# Altium project Portable_power_supply_v1.PrjPcb
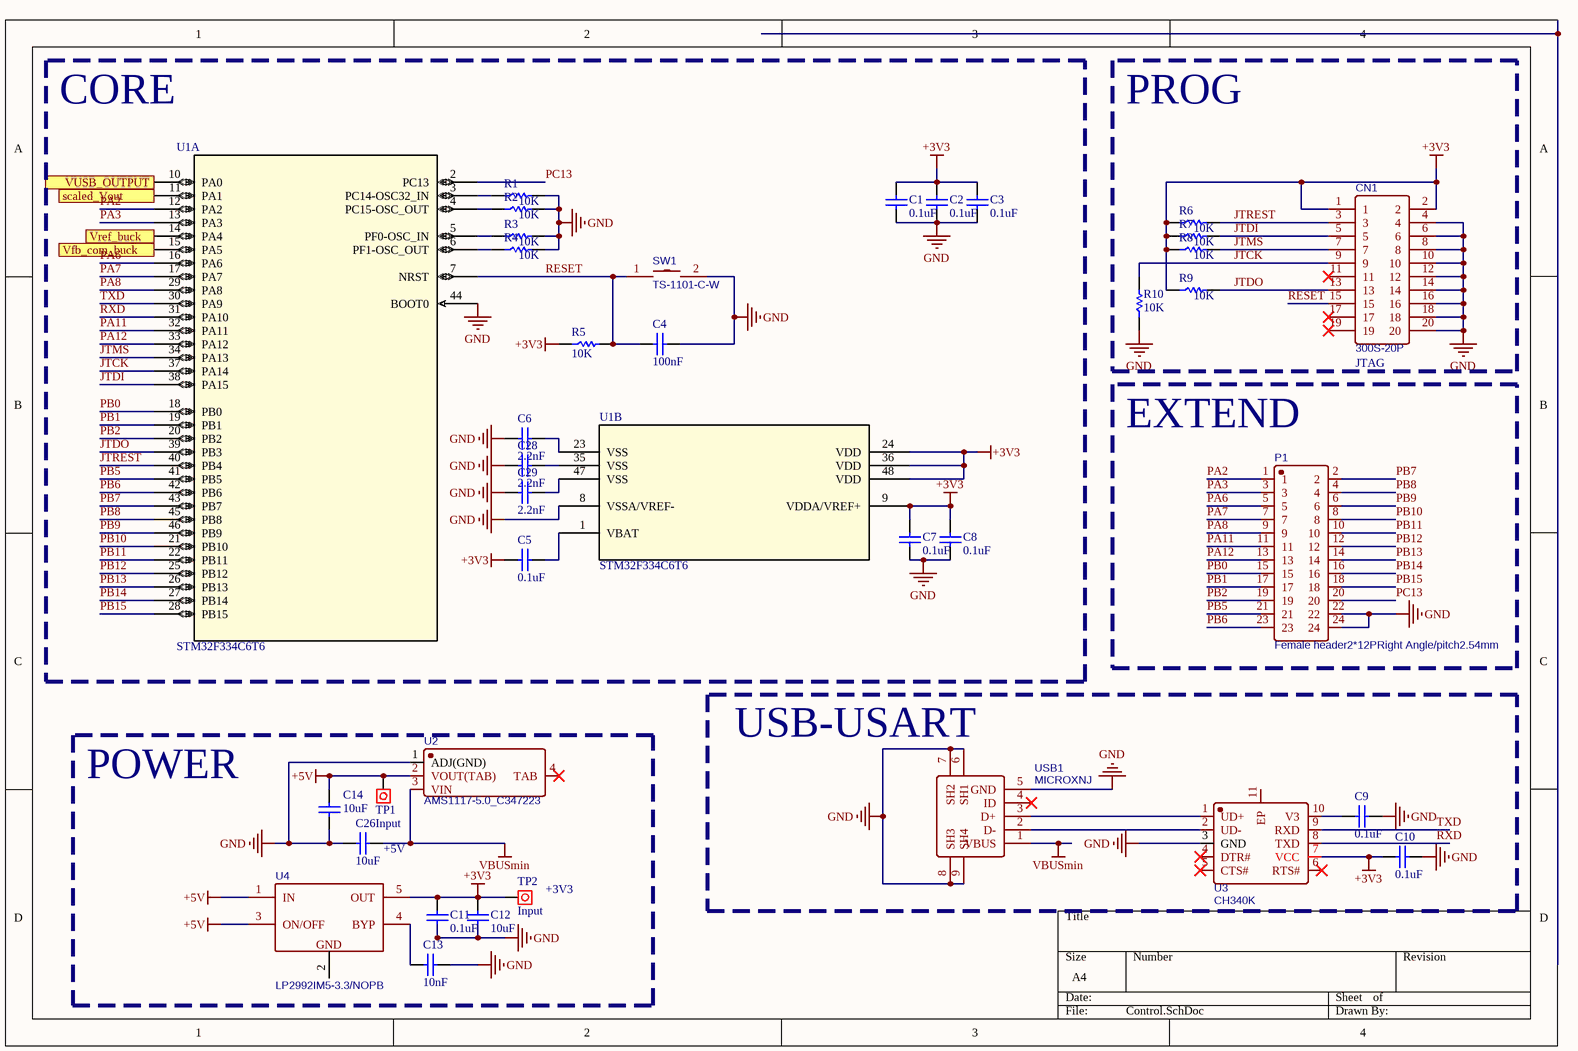
[diagram p0: Control.SchDoc]
2 sheets, 62 parts. Net scope: flat (ports and power ports of the same name join across sheets).
Board file: Portable power supply version2.PcbDoc
Sheets:
  Control.SchDoc
  Front(LDR).SchDoc

## Sheet Control.SchDoc
size A4; SheetNumber: 1; SheetTotal: 4

### Parts
C1  0.1uF  [0805C]
C2  0.1uF  [0805C]
C3  0.1uF  [0805C]
C4  100nF  [0805C]
C5  0.1uF  [0805C]
C6  2.2nF  [0805C]
C7  0.1uF  [0805C]
C8  0.1uF  [0805C]
C9  0.1uF  [0805C]
C10  0.1uF  [0805C]
C11  0.1uF  [0805C]
C12  10uF  [0805C]
C13  10nF  [0805C]
C14  10uF  [0805C]
C26  10uF  [0805C]
C28  2.2nF  [0805C]
C29  2.2nF  [0805C]
CN1  300S-20P  [CONN-TH_300S-20P]
P1  Female header2*12PRight Angle/pitch2.54mm  [HDR-TH_24P-P2.54-V-F-R2-C12-S2.54]
R1  10K  [0805]
R2  10K  [0805]
R3  10K  [0805]
R4  10K  [0805]
R5  10K  [0805]
R6  10K  [0805]
R7  10K  [0805]
R8  10K  [0805]
R9  10K  [0805]
R10  10K  [0805]
SW1  TS-1101-C-W  [SW-SMD_L6.0-W3.3-LS8.0]
TP1  INPUT  [Testpoin]
TP2  INPUT  [Testpoin]
U1  STM32F334C6T6  [LQFP48-7x7mm]  (parts A,B of 2)
U2  AMS1117-5.0_C347223  [SOT-223_L6.7-W3.5-P2.30-BR]
U3  CH340K  [ESOP-10_L4.9-W3.9-P1.00-LS6.2-BL-EP]
U4  LP2992IM5-3.3/NOPB  [SOT-23-5_L3.0-W1.7-P0.95-LS2.8-BR]
USB1  MICROXNJ  [MICRO-USB-SMD_MICROXNJ]

### Blocks framed on the sheet
CORE: C1-C8 C28 C29 R1-R5 SW1 U1
PROG: CN1 R6-R10
EXTEND: P1
POWER: C11-C14 C26 TP1 TP2 U2 U4
USB-USART: C9 C10 U3 USB1

### Ports
scaled_Vout (in), Vfb_com_buck (out), Vref_buck (out), VUSB_OUTPUT (in)

### Nets
+3V3: C1.1 C2.1 C3.1 C5.2 C7.1 C8.1 C10.2 C11.1 C12.1 CN1.1 CN1.2 R5.1 R6.1 R7.1 R8.1 R9.1 TP2.1 U1.9(VDDA/VREF+) U1.24(VDD) U1.36(VDD) U1.48(VDD) U3.7(VCC) U4.5(OUT)
+5V: C14.1 TP1.1 U2.2(VOUT(TAB)) U4.1(IN) U4.3(ON/OFF)
GND: C1.2 C2.2 C3.2 C4.1 C6.2 C7.2 C8.2 C9.2 C10.1 C11.2 C12.2 C13.1 C14.2 C26.2 C28.2 C29.2 CN1.4 CN1.6 CN1.8 CN1.10 CN1.12 CN1.14 CN1.16 CN1.18 CN1.20 P1.22 P1.24 R1.2 R2.2 R3.2 R4.2 R10.1 SW1.2 U1.8(VSSA/VREF-) U1.44(BOOT0) U2.1(ADJ(GND)) U3.3(GND) USB1.5(GND) USB1.6(SH1) USB1.7(SH2) USB1.8(SH3) USB1.9(SH4)
VBUSmin: C26.1 U2.3(VIN) USB1.1(VBUS)
JTCK: CN1.9 R10.2 U1.37(PA14)
JTDI: CN1.5 R7.2 U1.38(PA15)
JTDO: CN1.13 R9.2 U1.39(PB3)
JTMS: CN1.7 R8.2 U1.34(PA13)
JTREST: CN1.3 R6.2 U1.40(PB4)
PA2: P1.1 U1.12(PA2)
PA3: P1.3 U1.13(PA3)
PA6: P1.5 U1.16(PA6)
PA7: P1.7 U1.17(PA7)
PA8: P1.9 U1.29(PA8)
PA11: P1.11 U1.32(PA11)
PA12: P1.13 U1.33(PA12)
PB0: P1.15 U1.18(PB0)
PB1: P1.17 U1.19(PB1)
PB2: P1.19 U1.20(PB2)
PB5: P1.21 U1.41(PB5)
PB6: P1.23 U1.42(PB6)
PB7: P1.2 U1.43(PB7)
PB8: P1.4 U1.45(PB8)
PB9: P1.6 U1.46(PB9)
PB10: P1.8 U1.21(PB10)
PB11: P1.10 U1.22(PB11)
PB12: P1.12 U1.25(PB12)
PB13: P1.14 U1.26(PB13)
PB14: P1.16 U1.27(PB14)
PB15: P1.18 U1.28(PB15)
PC13: P1.20 U1.2(PC13)
RESET: C4.2 CN1.15 R5.2 SW1.1 U1.7(NRST)
RXD: U1.31(PA10) U3.8(TXD)
TXD: U1.30(PA9) U3.9(RXD)
NetC5_1: C5.1 U1.1(VBAT)
NetC6_1: C6.1 U1.23(VSS)
NetC9_1: C9.1 U3.10(V3)
NetC13_2: C13.2 U4.4(BYP)
NetC27_2: U1.10(PA0) ; port VUSB_OUTPUT
NetC28_1: C28.1 U1.35(VSS)
NetC29_1: C29.1 U1.47(VSS)
NetR1_1: R1.1 U1.3(PC14-OSC32_IN)
NetR2_1: R2.1 U1.4(PC15-OSC_OUT)
NetR3_1: R3.1 U1.5(PF0-OSC_IN)
NetR4_1: R4.1 U1.6(PF1-OSC_OUT)
NetU1_11: U1.11(PA1) ; port scaled_Vout
NetU1_14: U1.14(PA4) ; port Vref_buck
NetU1_15: U1.15(PA5) ; port Vfb_com_buck
NetU3_1: U3.1(UD+) USB1.3(D+)
NetU3_2: U3.2(UD-) USB1.2(D-)

Not connected (* = marked no-connect by the designer): CN1 11* 17* 19*; U2 4(TAB)*; U3 4(DTR#)* 5(CTS#)* 6(RTS#)* 11(EP); U4 2(GND); USB1 4(ID)*

### Notes on the sheet
- (near CN1) JTAG
- (near C26) +5V
- (near TP2) +3V3

### Library data of the parts
C1-C3 C5 C7-C11 = C_0.1uf: Capacitor; Reviewed by: RM - 2018/08/05; Revision: July-2002: Re-released for DXP Platform.; Supplier 1: *; Supplier Part Number 1: *; Value: 0.1uF
C4 = C_100nf: Capacitor; Reviewed by: RM - 2018/08/05; Revision: July-2002: Re-released for DXP Platform.; Supplier 1: *; Supplier Part Number 1: *; Value: 100nF
C6 C28 C29 = C_2.2nF: Capacitor; Reviewed by: RM - 2018/08/05; Revision: July-2002: Re-released for DXP Platform.; Supplier 1: *; Supplier Part Number 1: *; Value: 2.2nF
C12 C14 C26 = C_10uf: Capacitor; Reviewed by: RM - 2018/08/05; Revision: July-2002: Re-released for DXP Platform.; Supplier 1: *; Supplier Part Number 1: *; Value: 10uF
C13 = C_10nF: Capacitor; Reviewed by: RM - 2018/08/05; Revision: July-2002: Re-released for DXP Platform.; Supplier 1: *; Supplier Part Number 1: *; Value: 10nF
CN1 = 300S-20P: BOM_Manufacturer: Shenzhen Cankemeng; Contributor: LCSC; BOM_Supplier: LCSC; BOM_Supplier Part: C132442; BOM_Manufacturer Part: -; BOM_JLCPCB Part Class: Extended Part; spicePre: C; spiceSymbolName: 300S-20P
P1 = Female header2*12PRight Angle/pitch2.54mm: BOM_Manufacturer: BOOMELE; BOM_Supplier: LCSC; BOM_Manufacturer Part: Female header2*12PRight Angle/pitch2.54mm; BOM_Supplier Part: C62744; BOM_JLCPCB Part Class: Extended Part; spicePre: P; spiceSymbolName: Female header2*12PRight Angle/pitch2.54mm
R1-R10 = R_10k: Resistor; Reviewed by: RM - 2018/08/05; Supplier 1: *; Suppler Part Number 1: *; Value: 10K
SW1 = TS-1101-C-W: BOM_Manufacturer: XKB Connectivity(中国星坤); Contributor: LCSC; BOM_Supplier: LCSC; BOM_Supplier Part: C318938; BOM_Manufacturer Part: TS-1101-C-W; BOM_JLCPCB Part Class: Extended Part; spicePre: S; spiceSymbolName: TS-1101-C-W
TP1 TP2 = Test Point: Pad; Value: Input
U1 = STM32F334C6T6: No Description Available; Mfr_Name: STMicroelectronics; Copyright: Copyright (C) 2021 Ultra Librarian. All rights reserved.; Manufacturer_Part_Number: STM32F334C6T6; RefDes: RefDes; Type: DEV
U2 = AMS1117-5.0_C347223: BOM_Manufacturer: Youtai Semiconductor Co., Ltd.; Contributor: LCSC; BOM_Supplier: LCSC; BOM_Supplier Part: C347223; BOM_Manufacturer Part: AMS1117-5.0; BOM_JLCPCB Part Class: Extended Part; spicePre: U; spiceSymbolName: AMS1117-5.0_C347223
U3 = CH340K: BOM_Manufacturer: WCH(Jiangsu Qin Heng); Contributor: LCSC; BOM_Supplier: LCSC; BOM_Supplier Part: C968586; BOM_Manufacturer Part: CH340K; BOM_JLCPCB Part Class: Extended Part; spicePre: U; spiceSymbolName: CH340K
U4 = LP2992IM5-3.3/NOPB: BOM_Manufacturer: TI; Contributor: LCSC; BOM_Supplier: LCSC; BOM_Manufacturer Part: LP2992IM5-3.3/NOPB; BOM_Supplier Part: C129353; BOM_JLCPCB Part Class: Extended Part; spicePre: U; spiceSymbolName: LP2992IM5-3.3/NOPB
USB1 = MICROXNJ: BOM_Manufacturer: SHOU HAN; Contributor: LCSC; BOM_Supplier: LCSC; BOM_Supplier Part: C404969; BOM_Manufacturer Part: MicroXNJ; BOM_JLCPCB Part Class: Extended Part; spicePre: U; spiceSymbolName: MICROXNJ

## Sheet Front(LDR).SchDoc
size A4; SheetNumber: 2; SheetTotal: 4
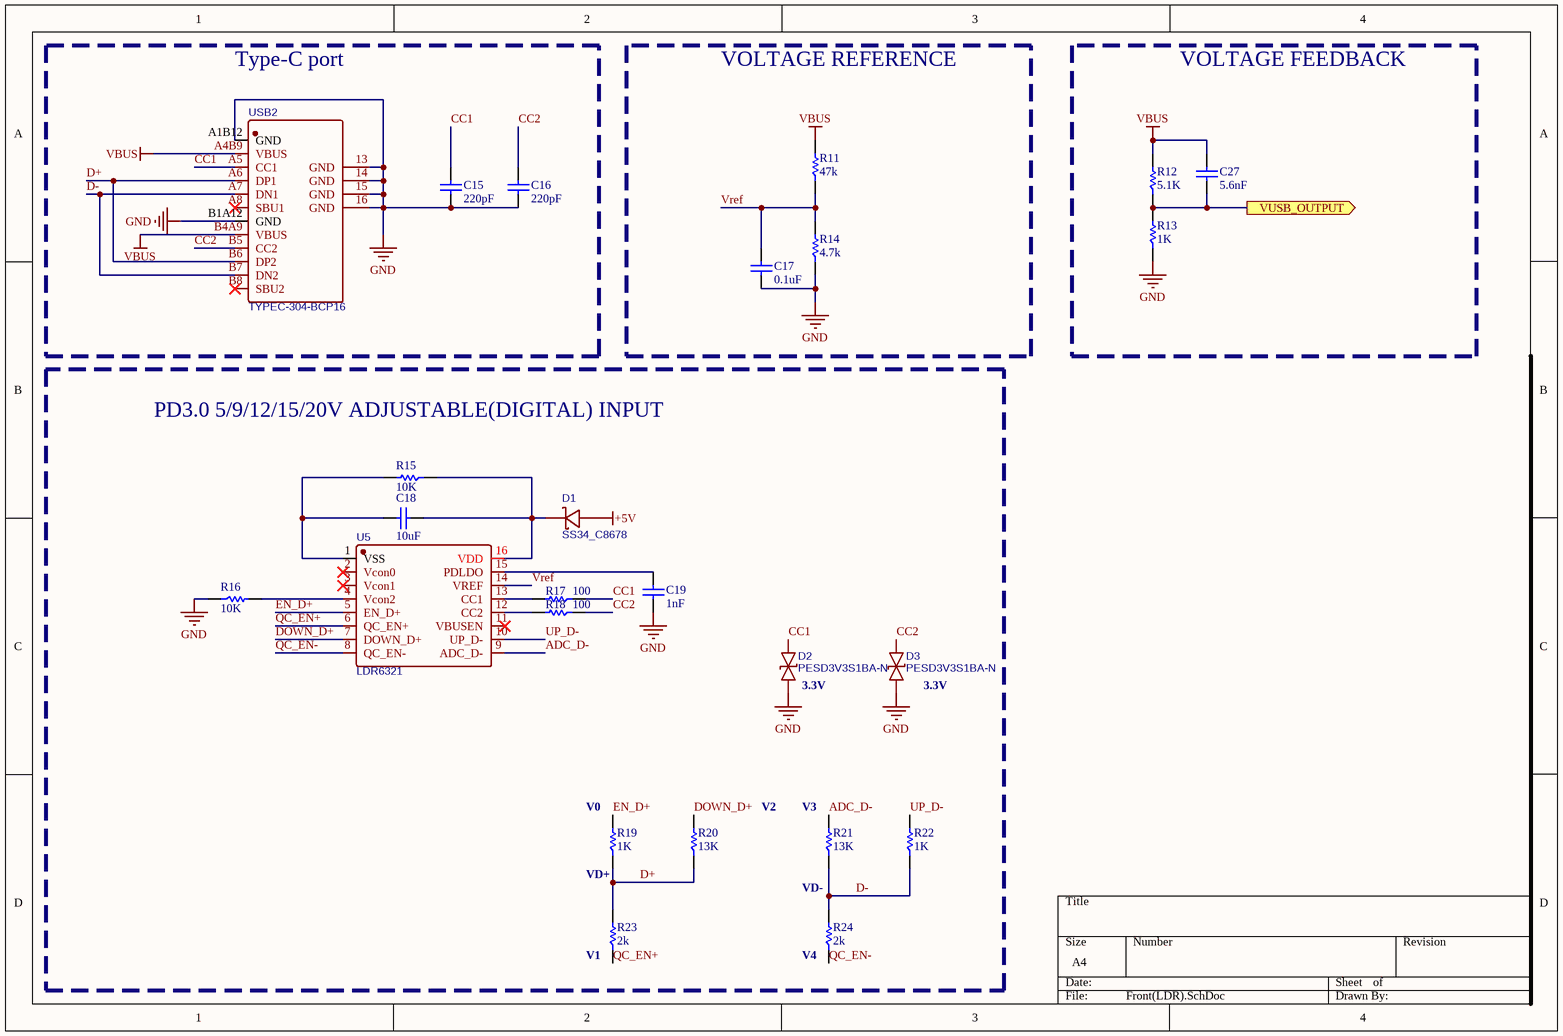
[diagram p1: Front(LDR).SchDoc]

### Parts
C15  220pF  [0805C]
C16  220pF  [0805C]
C17  0.1uF  [0805C]
C18  10uF  [0805C]
C19  1nF  [0805C]
C27  5.6nF  [0805C]
D1  SS34_C8678  [DO-214AC_L4.3-W2.7-LS5.3-RD]
D2  PESD3V3S1BA-N  [SOD-523_L1.2-W0.8-LS1.6-BI]
D3  PESD3V3S1BA-N  [SOD-523_L1.2-W0.8-LS1.6-BI]
R11  47k  [0805]
R12  5.1K  [0805]
R13  1K  [0805]
R14  4.7k  [0805]
R15  10K  [0805]
R16  10K  [0805]
R17  100  [0805]
R18  100  [0805]
R19  1K  [0805]
R20  13K  [0805]
R21  13K  [0805]
R22  1K  [0805]
R23  2k  [0805]
R24  2k  [0805]
U5  LDR6321  [SSOP-16_L5.0-W4.4-P0.65-LS6.4-BL]
USB2  TYPEC-304-BCP16  [USB-C-SMD_TYPEC-304-BCP16]

### Blocks framed on the sheet
Type-C port: C15 C16 USB2
VOLTAGE REFERENCE: C17 R11 R14
VOLTAGE FEEDBACK: C27 R12 R13
PD3.0 5/9/12/15/20V ADJUSTABLE(DIGITAL) INPUT: C18 C19 D1-D3 R15-R24 U5

### Ports
VUSB_OUTPUT (out)

### Nets
+5V: D1.2(A)
GND: C15.2 C16.2 C17.2 C19.2 D2.1 D3.1 R13.1 R14.1 R16.1 USB2.13(GND) USB2.14(GND) USB2.15(GND) USB2.16(GND) USB2.A1B12(GND) USB2.B1A12(GND)
VBUS: C27.1 R11.2 R12.2 USB2.A4B9(VBUS) USB2.B4A9(VBUS)
ADC_D-: R21.2 U5.9(ADC_D-)
CC1: C15.1 D2.2 R17.1 USB2.A5(CC1)
CC2: C16.1 D3.2 R18.1 USB2.B5(CC2)
D+: R19.1 R20.1 R23.2 USB2.A6(DP1) USB2.B6(DP2)
D-: R21.1 R22.1 R24.2 USB2.A7(DN1) USB2.B7(DN2)
DOWN_D+: R20.2 U5.7(DOWN_D+)
EN_D+: R19.2 U5.5(EN_D+)
QC_EN+: R23.1 U5.6(QC_EN+)
QC_EN-: R24.1 U5.8(QC_EN-)
UP_D-: R22.2 U5.10(UP_D-)
Vref: C17.1 R11.1 R14.2 U5.14(VREF)
NetC18_1: C18.1 R15.2 U5.1(VSS)
NetC18_2: C18.2 D1.1(K) R15.1 U5.16(VDD)
NetC19_1: C19.1 U5.15(PDLDO)
NetC27_2: C27.2 R12.1 R13.2 ; port VUSB_OUTPUT
NetR16_2: R16.2 U5.4(Vcon2)
NetR17_2: R17.2 U5.13(CC1)
NetR18_2: R18.2 U5.12(CC2)

Not connected (* = marked no-connect by the designer): U5 2(Vcon0)* 3(Vcon1)* 11(VBUSEN)*; USB2 A8(SBU1)* B8(SBU2)*

### Notes on the sheet
- (near D2) 3.3V
- (near D3) 3.3V
- (near R19) V0
- V2
- (near R21) V3
- (near R19) VD+
- VD-
- (near R23) V1
- (near R24) V4

### Library data of the parts
C15 C16 = C_220pF: Capacitor; Reviewed by: RM - 2018/08/05; Revision: July-2002: Re-released for DXP Platform.; Supplier 1: *; Supplier Part Number 1: *; Value: 220pF
C17 = C_0.1uf: Capacitor; Reviewed by: RM - 2018/08/05; Revision: July-2002: Re-released for DXP Platform.; Supplier 1: *; Supplier Part Number 1: *; Value: 0.1uF
C18 = C_10uf: Capacitor; Reviewed by: RM - 2018/08/05; Revision: July-2002: Re-released for DXP Platform.; Supplier 1: *; Supplier Part Number 1: *; Value: 10uF
C19 = C_1nf: Capacitor; Reviewed by: RM - 2018/08/05; Revision: July-2002: Re-released for DXP Platform.; Supplier 1: *; Supplier Part Number 1: *; Value: 1nF
C27 = C_5.6nf: Capacitor; Reviewed by: RM - 2018/08/05; Revision: July-2002: Re-released for DXP Platform.; Supplier 1: *; Supplier Part Number 1: *; Value: 5.6nF
D1 = SS34_C8678: BOM_Manufacturer Part: SS34; BOM_Manufacturer: MDD; BOM_Supplier: LCSC; BOM_Supplier Part: C8678; BOM_JLCPCB Part Class: Basic Part; spicePre: D; spiceSymbolName: SS34_C8678
D2 D3 = PESD3V3S1BA-N: TVS3V3; BOM_Manufacturer: Bourne Semicon (Shenzhen); Contributor: LCSC; BOM_Supplier: LCSC; BOM_Supplier Part: C316037; BOM_Manufacturer Part: PESD3V3S1BA-N; BOM_JLCPCB Part Class: Extended Part; spicePre: D; spiceSymbolName: PESD3V3S1BA-N
R11 = R_47k: Resistor; Reviewed by: RM - 2018/08/05; Supplier 1: *; Suppler Part Number 1: *; Value: 47k
R12 = R_5.1k: Resistor; Reviewed by: RM - 2018/08/05; Supplier 1: *; Suppler Part Number 1: *; Value: 5.1K
R13 R19 R22 = R_1k: Resistor; Reviewed by: RM - 2018/08/05; Supplier 1: *; Suppler Part Number 1: *; Value: 1K
R14 = R_4.7k: Resistor; Reviewed by: RM - 2018/08/05; Supplier 1: *; Suppler Part Number 1: *; Value: 4.7k
R15 R16 = R_10k: Resistor; Reviewed by: RM - 2018/08/05; Supplier 1: *; Suppler Part Number 1: *; Value: 10K
R17 R18 = R_100: Resistor; Reviewed by: RM - 2018/08/05; Supplier 1: *; Suppler Part Number 1: *; Value: 100
R20 R21 = R_13k: Resistor; Reviewed by: RM - 2018/08/05; Supplier 1: *; Suppler Part Number 1: *; Value: 13K
R23 R24 = R_2k: Resistor; Reviewed by: RM - 2018/08/05; Supplier 1: *; Suppler Part Number 1: *; Value: 2k
U5 = LDR6321: BOM_Manufacturer: Legendary(乐得瑞); Contributor: LCSC; BOM_Supplier: LCSC; BOM_Supplier Part: C2919632; BOM_Manufacturer Part: LDR6321; BOM_JLCPCB Part Class: Extended Part; spicePre: U; spiceSymbolName: LDR6321
USB2 = TYPEC-304-BCP16: BOM_Manufacturer: XUNPU; Contributor: LCSC; BOM_Supplier: LCSC; BOM_Supplier Part: C720629; BOM_Manufacturer Part: TYPEC-304-BCP16; BOM_JLCPCB Part Class: Extended Part; spicePre: U; spiceSymbolName: TYPEC-304-BCP16

## Nets that join several sheets
+5V: Control (5 pins), Front(LDR) (D1.2)
GND: Control (42 pins), Front(LDR) (15 pins)
NetC27_2: Control (U1.10), Front(LDR) (C27.2 R12.1 R13.2)